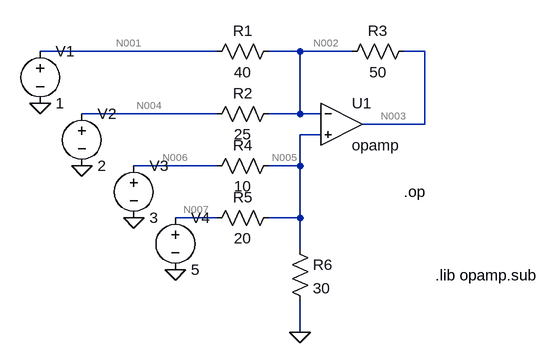
[diagram p0: schematic pag7es2p2.asc]
pag7es2p2.asc, the LTspice schematic file:
Version 4
SHEET 1 880 680
WIRE 32 48 -240 48
WIRE 160 48 112 48
WIRE 240 48 160 48
WIRE 352 48 320 48
WIRE 32 144 -176 144
WIRE 160 144 160 48
WIRE 160 144 112 144
WIRE 192 144 160 144
WIRE 352 160 352 48
WIRE 352 160 256 160
WIRE 192 176 160 176
WIRE 32 224 -96 224
WIRE 160 224 160 176
WIRE 160 224 112 224
WIRE 32 304 -32 304
WIRE 160 304 160 224
WIRE 160 304 112 304
WIRE 160 352 160 304
WIRE 160 480 160 432
FLAG 160 480 0
FLAG -32 384 0
FLAG -96 304 0
FLAG -176 224 0
FLAG -240 128 0
SYMBOL OpAmps\\opamp 224 96 R0
SYMATTR InstName U1
SYMBOL res 128 128 R90
WINDOW 0 0 56 VBottom 2
WINDOW 3 32 56 VTop 2
SYMATTR InstName R2
SYMATTR Value 25
SYMBOL res 128 32 R90
WINDOW 0 0 56 VBottom 2
WINDOW 3 32 56 VTop 2
SYMATTR InstName R1
SYMATTR Value 40
SYMBOL res 336 32 R90
WINDOW 0 0 56 VBottom 2
WINDOW 3 32 56 VTop 2
SYMATTR InstName R3
SYMATTR Value 50
SYMBOL res 128 208 R90
WINDOW 0 0 56 VBottom 2
WINDOW 3 32 56 VTop 2
SYMATTR InstName R4
SYMATTR Value 10
SYMBOL res 128 288 R90
WINDOW 0 0 56 VBottom 2
WINDOW 3 32 56 VTop 2
SYMATTR InstName R5
SYMATTR Value 20
SYMBOL res 144 336 R0
SYMATTR InstName R6
SYMATTR Value 30
SYMBOL voltage -32 288 R0
SYMATTR InstName V4
SYMATTR Value 5
SYMBOL voltage -96 208 R0
SYMATTR InstName V3
SYMATTR Value 3
SYMBOL voltage -176 128 R0
SYMATTR InstName V2
SYMATTR Value 2
SYMBOL voltage -240 32 R0
SYMATTR InstName V1
SYMATTR Value 1
TEXT 368 392 Left 2 !.lib opamp.sub
TEXT 320 264 Left 2 !.op

The netlist it stands for:
* pag7es2p2.asc
XU1 N002 N005 N003 opamp Aol=100K GBW=10Meg  ; pins invin noninvin out
R2 N002 N004 25
R1 N002 N001 40
R3 N003 N002 50
R4 N005 N006 10
R5 N005 N007 20
R6 N005 0 30
V4 N007 0 5
V3 N006 0 3
V2 N004 0 2
V1 N001 0 1
.lib opamp.sub
.op
.backanno
.end

* Results of the author's LTspice run, read from the files saved beside the schematic
* Operating Point:
*   V(n003) = 7.5 V
*   V(n005) = 3 V
*   V(n002) = 3 V
*   V(n004) = 2 V
*   V(n001) = 1 V
*   V(n006) = 3 V
*   V(n007) = 5 V
*   I(R6) = 100 mA
*   I(R5) = -100 mA
*   I(R4) = 0 A
*   I(R3) = 90 mA
*   I(R1) = 50 mA
*   I(R2) = 40 mA
*   I(V1) = 50 mA
*   I(V2) = 40 mA
*   I(V3) = 0 A
*   I(V4) = -100 mA
*   Ix(u1:3) = -90 mA